# EAGLE design Schematics-2 (EAGLE 7.5.0)
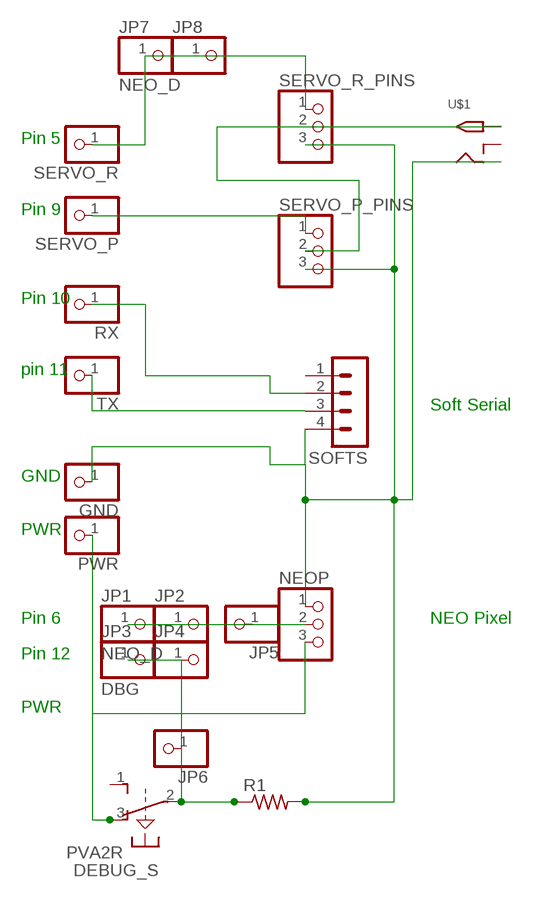
[diagram p0: schematic, sheet 1]

## Parts
DEBUG_S  PVA2R  [PVA2R]
GND  PINHD-1X1CB  [1X01-CLEANBIG]
JP1  NEO_D  PINHD-1X1CB  [1X01-CLEANBIG]
JP2  PINHD-1X1CB  [1X01-CLEANBIG]
JP3  DBG  PINHD-1X1CB  [1X01-CLEANBIG]
JP4  PINHD-1X1CB  [1X01-CLEANBIG]
JP5  PINHD-1X1CB  [1X01-CLEANBIG]
JP6  PINHD-1X1CB  [1X01-CLEANBIG]
JP7  NEO_D  PINHD-1X1CB  [1X01-CLEANBIG]
JP8  PINHD-1X1CB  [1X01-CLEANBIG]
NEOP  PINHD-1X3CB  [1X03-CLEANBIG]
PWR  PINHD-1X1CB  [1X01-CLEANBIG]
R1  R-US_0204/7  [0204/7]
RX  PINHD-1X1CB  [1X01-CLEANBIG]
SERVO_P  PINHD-1X1CB  [1X01-CLEANBIG]
SERVO_P_PINS  PINHD-1X3CB  [1X03-CLEANBIG]
SERVO_R  PINHD-1X1CB  [1X01-CLEANBIG]
SERVO_R_PINS  PINHD-1X3CB  [1X03-CLEANBIG]
SOFTS  MA04-1  [MA04-1]
TX  PINHD-1X1CB  [1X01-CLEANBIG]
U$1  2.1MMJACKTHM  [PJ-102A]

## Nets
N$1: RX.1 SOFTS.2
N$2: JP1.1 JP2.1 JP5.1 NEOP.2
N$3: SOFTS.3 TX.1
N$4: GND.1 NEOP.1 R1.2 SERVO_P_PINS.3 SERVO_R_PINS.3 SOFTS.4 U$1.RING
N$5: DEBUG_S.3(1:O) NEOP.3 PWR.1
N$8: DEBUG_S.2(1:P) JP3.1 JP4.1 JP6.1 R1.1
N$9: SERVO_P_PINS.2 SERVO_R_PINS.2 U$1.TIP
N$10: JP7.1 JP8.1 SERVO_R.1 SERVO_R_PINS.1
N$12: SERVO_P.1 SERVO_P_PINS.1
Unconnected: DEBUG_S.1(1:S) DEBUG_S.4(2:S) DEBUG_S.5(2:P) DEBUG_S.6(2:O) SOFTS.1 U$1.RING_SW

## Notes on the sheet
- Pin 5
- Pin 9
- Pin 10
- pin 11
- Soft Serial
- GND
- PWR
- Pin 6 | NEO Pixel
- Pin 12
- PWR

## Library data of the parts
DEBUG_S = switch-misc:PVA2R: ITT SWITCH
GND JP1-JP8 PWR RX SERVO_P SERVO_R TX = adafruit:PINHD-1X1: Pin header 1x1 for 0.1" spacing With round pins
NEOP SERVO_P_PINS SERVO_R_PINS = adafruit:PINHD-1X3: PIN HEADER
R1 = adafruit:R-US_: RESISTOR, American symbol
SOFTS = con-lstb:MA04-1: PIN HEADER; OC_FARNELL: unknown; OC_NEWARK: unknown
U$1 = adafruit:2.1MMJACK: 2.1mm x 5.5mm THM DC jack with internal switch. Digikey part #PJ-102A, 4UCON part #05537 2.1mm x 5.5mm SMT DC jack with internal switch. Digikey part #PJ-002A-SMT, 4UCON part #03267 By microbuilder.eu & adafruit.com

## Board
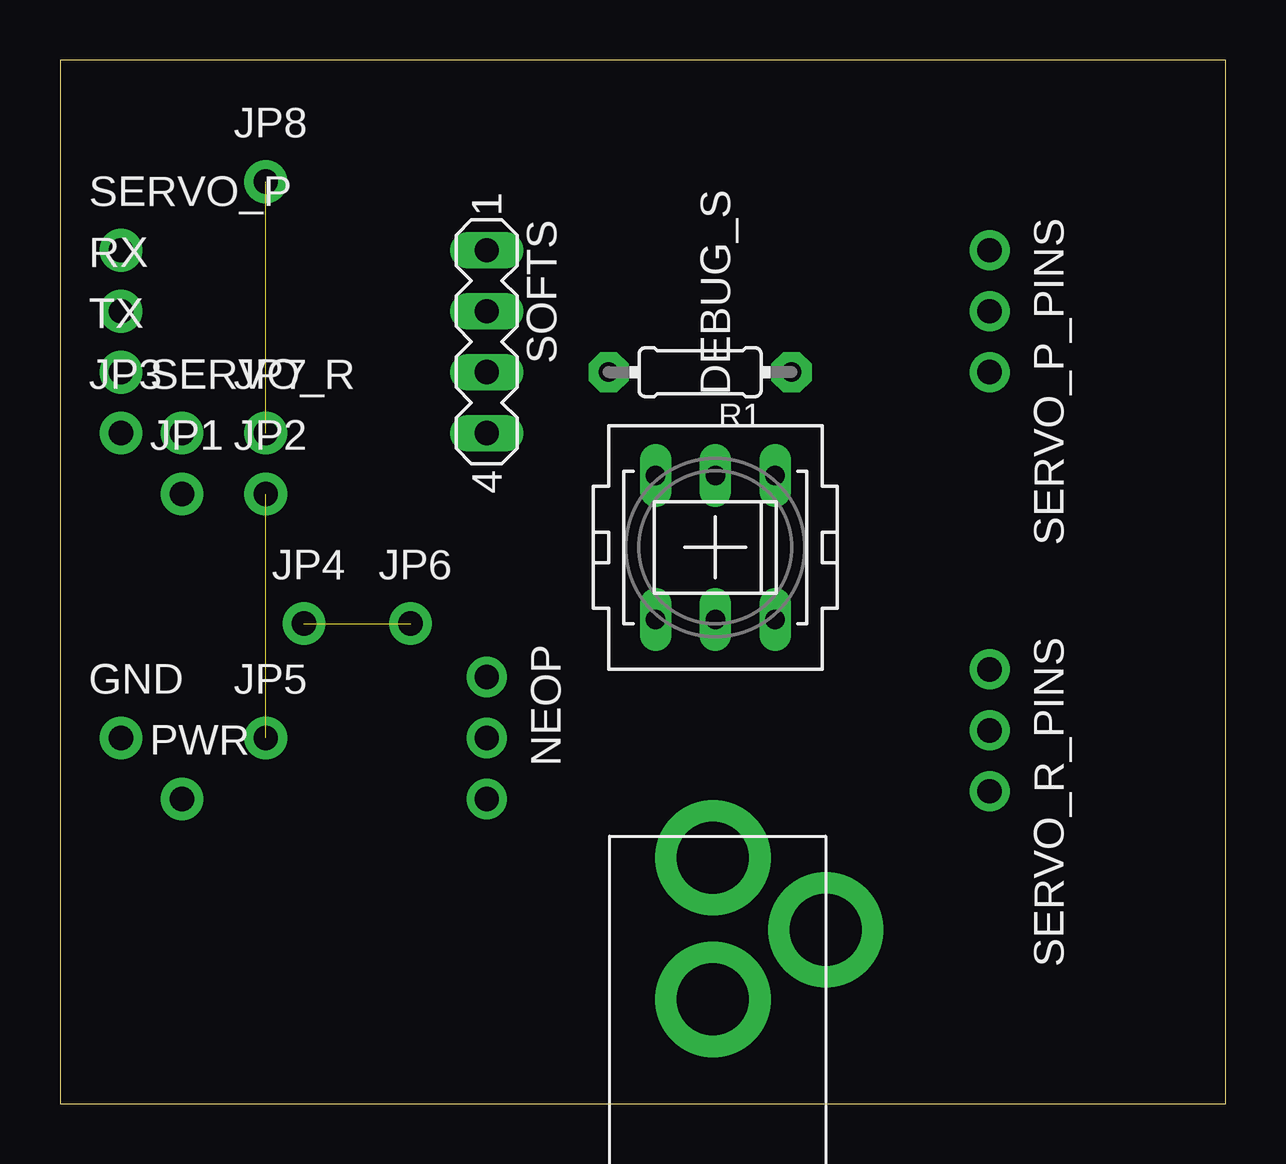
[diagram p1: board, top side]
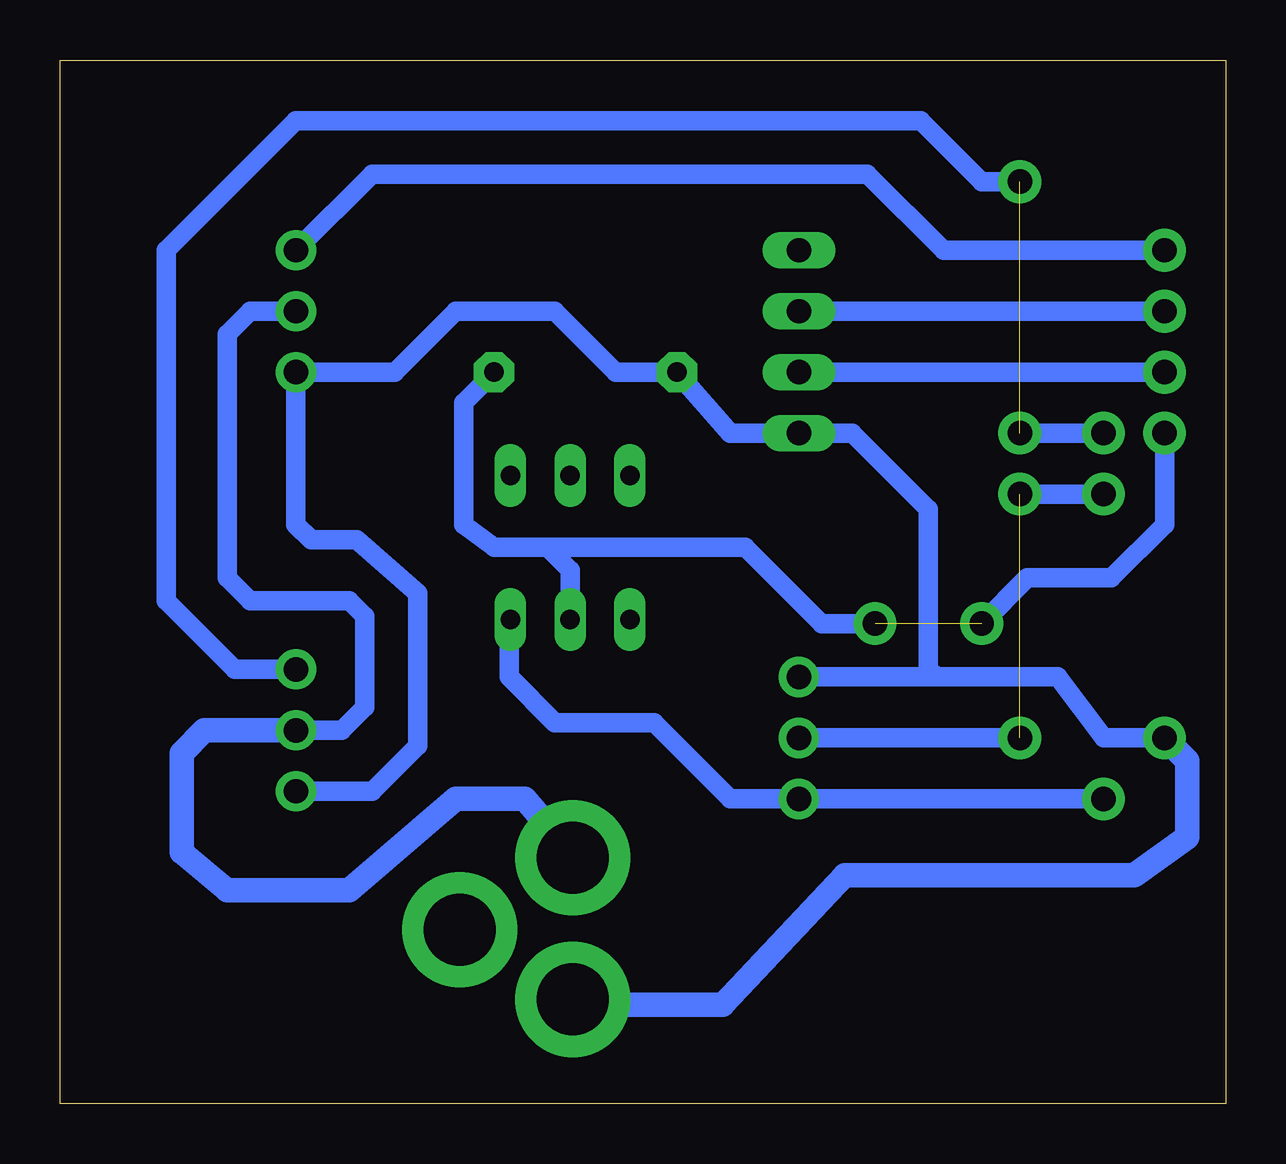
[diagram p2: board, bottom side, seen from below]

Size 48.56 x 43.49 mm. Coordinates in mm from the lower left corner, seen from the top.
Outline: 0,0 48.56,0 48.56,43.49 0,43.49 0,0
Copper layers (1*16): Top 0.035mm / dielectric 1.5mm / Bottom 0.035mm
Design rules "default": minimum track width 10mil, minimum drill 24mil, track to track 8mil, track to pad 8mil, pad to pad 8mil, via to via 8mil, smd to smd 8mil, copper to edge 40mil, drill to drill 8mil, minimum pad ring 10mil, minimum via ring 8mil, stop-mask expansion 4mil, vias tented up to drill 0mil, thermal gap 10mil

### Footprints (pad centres in the part's own frame; a part is rotated, then mirrored left to right if it is on the bottom)
PVA2R = drill 0.813 long: 1 -2.997,2.489; 2 -2.997,0; 3 -2.997,-2.489; 4 2.997,2.489; 5 2.997,0; 6 2.997,-2.489
1X01-CLEANBIG = drill 1.016 pad 1.778: 1 0,0
1X03-CLEANBIG = drill 1.016 pad 1.676: 1 -2.54,0; 2 0,0; 3 2.54,0
0204/7 = drill 0.813 pad 1.676 octagon: 1 -3.81,0; 2 3.81,0
MA04-1 = drill 1.016 long: 1 -3.81,0; 2 -1.27,0; 3 1.27,0; 4 3.81,0
PJ-102A = drill 3 pad 4.8: RING 0.1,-3.39; RING_SW -4.6,-6.29; TIP 0.1,-9.29

### Placement (x,y rotation side)
DEBUG_S  27.3,23.18 90 top
GND  2.54,15.24 0 top
JP1  5.08,25.4 0 top
JP2  8.57,25.4 0 top
JP3  2.54,27.94 0 top
JP4  10.16,20 0 top
JP5  8.57,15.24 0 top
JP6  14.61,20 0 top
JP7  8.57,27.94 0 top
JP8  8.57,38.42 0 top
NEOP  17.78,15.24 270 top
PWR  5.08,12.7 0 top
R1  26.67,30.48 180 top
RX  2.54,33.02 0 top
SERVO_P  2.54,35.56 0 top
SERVO_P_PINS  38.73,33.02 270 top
SERVO_R  5.08,27.94 0 top
SERVO_R_PINS  38.73,15.56 270 top
SOFTS  17.78,31.75 270 top
TX  2.54,30.48 0 top
U$1  27.3,0.95 180 top

### Tracks (layer width: path | path; a pad name or v marks a point on that pad's centre or on a via)
N$1
  Bottom 0.813: RX.1 SOFTS.2
N$2  (1 unrouted)
  Bottom 0.813: JP1.1 JP2.1 | JP5.1 NEOP.2
N$3
  Bottom 0.813: SOFTS.3 TX.1
N$4
  Bottom 0.813: GND.1 5.08,15.24 6.99,17.78 12.06,17.78 | NEOP.1 12.06,17.78 | SERVO_R_PINS.3 35.56,13.02 33.66,14.92 33.66,21.27 36.2,23.5 38.1,23.5 38.73,24.13 SERVO_P_PINS.3 34.61,30.48 32.07,33.02 27.94,33.02 25.4,30.48 R1.2 20.64,27.94 SOFTS.4 15.56,27.94 12.38,24.77 12.38,18.1 12.06,17.78
  Bottom 1.016: GND.1 1.59,14.29 1.59,11.11 3.81,9.53 15.88,9.53 20.95,4.13 27.1,4.13 U$1.RING
N$5
  Bottom 0.813: DEBUG_S.3 29.84,20.13 29.84,17.78 27.94,15.88 23.81,15.88 20.64,12.7 NEOP.3 PWR.1
N$8  (1 unrouted)
  Bottom 0.813: JP3.1 2.54,24.13 4.76,21.91 8.26,21.91 JP4.1 | DEBUG_S.2 27.3,22.23 28.26,23.18 | 28.26,23.18 30.48,23.18 31.75,24.13 31.75,29.21 R1.1 | JP6.1 16.83,20 20,23.18 28.26,23.18
N$9
  Bottom 0.813: SERVO_P_PINS.2 40.64,33.02 41.59,32.07 41.59,21.91 40.64,20.95 36.51,20.95 35.88,20.32 35.88,16.51 36.83,15.56 SERVO_R_PINS.2
  Bottom 1.016: U$1.TIP 27.2,10.38 29.21,12.7 32.07,12.7 36.51,8.89 41.59,8.89 43.5,10.48 43.5,14.61 42.55,15.56 SERVO_R_PINS.2
N$10  (1 unrouted)
  Bottom 0.813: SERVO_R.1 JP7.1 | JP8.1 10.16,38.42 12.7,40.96 38.73,40.96 44.13,35.56 44.13,20.95 41.27,18.1 SERVO_R_PINS.1
N$12
  Bottom 0.813: SERVO_P.1 11.75,35.56 14.92,38.73 35.56,38.73 SERVO_P_PINS.1